# Altium schematic sheet 3V3_Regulator.SchDoc
size Letter; SheetNumber: 4; SheetTotal: 13
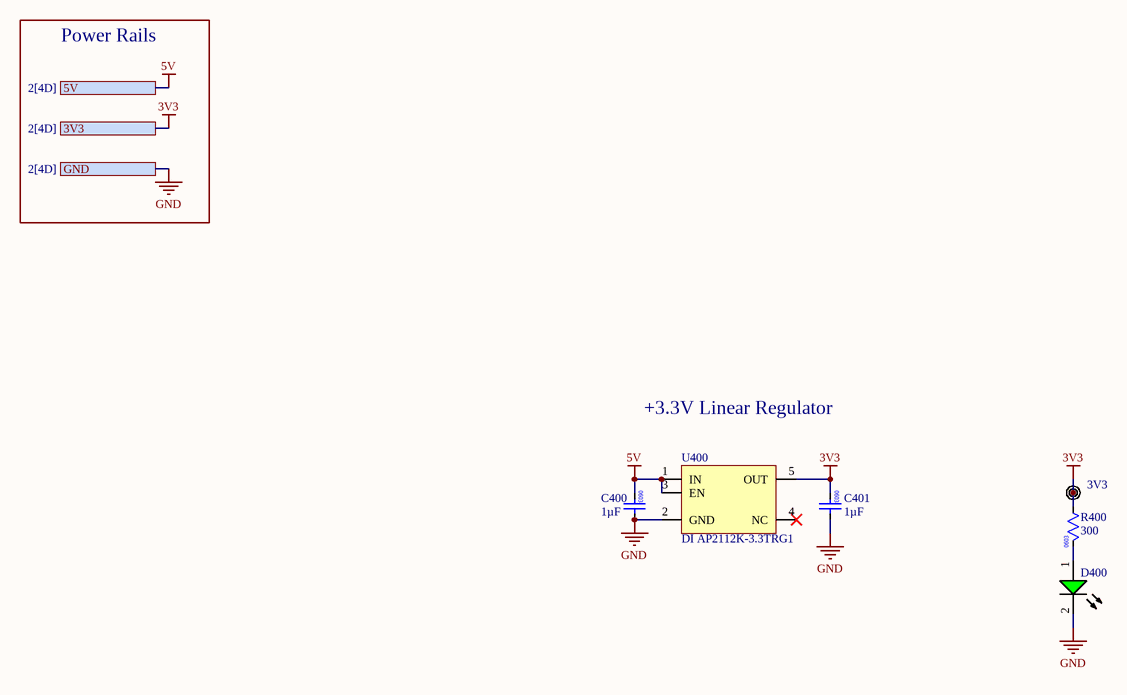
[diagram p0: 3V3_Regulator.SchDoc]

## Parts
C400  value 1µF  [0603 Capacitor Footprint]  (hidden comment: 0603 1uF 10% 25V)
C401  value 1µF  [0603 Capacitor Footprint]  (hidden comment: 0603 1uF 10% 25V)
D400  Lite-On LTST-C193KGKT-5A  [Lite-On LTST-C193KGKT-5A GREEN (1608)]  (value not drawn)
R400  value 300  [0603 Resistor Footprint]  (hidden comment: 0603 300 1% 0.33W)
TP400  3V3  [TESTPOINT]  (no BOM)
U400  DI AP2112K-3.3TRG1  [DI AP2112K-3.3TRG1]

## Ports
3V3 (see 2[4D]), 5V (see 2[4D]), GND (see 2[4D])

## Nets
3V3: C401.2 R400.1 TP400.1(TP) U400.5(OUT) ; port 3V3
5V: C400.2 U400.1(IN) U400.3(EN) ; port 5V
GND: C400.1 C401.1 D400.2(K) U400.2(GND) ; port GND
NetD400_1: D400.1(A) R400.2

Not connected (* = marked no-connect by the designer): U400 4(NC)*

## Notes on the sheet
- Power Rails
- +3.3V Linear Regulator

## Library data of the parts
C400 C401 = CMP-001-00092-5: CAP CER 1UF 25V X7R 0603; Manufacturer Part Number: GCM188R71E105KA64J; Capacitor Type: Ceramic; Case/Package: 0603; Max Operating Temperature: 125°C; Supplier Part Number 1: 490-GCM188R71E105KA64JCT-ND; RoHS Compliant: Yes; Supplier 1: Digikey; Pins: 2; Digikey Part Number: 490-GCM188R71E105KA64JCT-ND; Tolerance: 10%; Voltage Rating: 25V; Mounting Technology: Surface Mount; Min Operating Temperature: -55°C
D400 = CMP-026-000009-1: LED GREEN CLEAR CHIP SMD; Source: UBC Formula Electric.SchLib; Supplier 1: Digi-Key; Supplier Part Number 1: 160-1828-1-ND; Design Item ID: Lite-On LTST-C193KGKT-5A
R400 = CMP-009-00191-7: RES SMD 300 OHM 1% 1/3W 0603; Manufacturer Part Number: CRCW0603300RFKEAHP; Power: 250mW; Tolerance: 1%; Max Operating Temperature: 155°C; Digikey Part Number: 541-CRCW0603300RFKEAHPCT-ND; Case/Package: 0603; Mounting Technology: Surface Mount; Pins: 2; RoHS Compliant: Yes; Min Operating Temperature: -55°C
TP400 = CMP-020-0000-4: Design Item ID: Thru-Hole Test Point; Source: UBC Formula Electric.SchLib
U400 = CMP-010-0000-1: Linear Voltage Regulator IC Positive Fixed 1 Output  600mA SOT-25; Design Item ID: DI AP2112K-3.3TRG1; Component Type: Standard; Source: Quad_Inverter.SchLib; Pins: 5